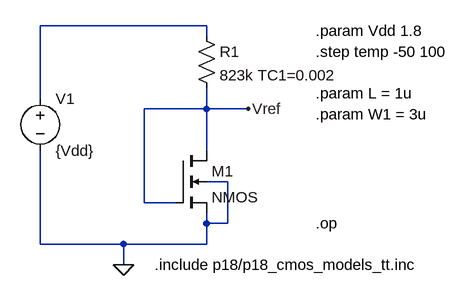
[diagram p0: schematic MOS_RESISTOR_V2-vref.asc]
MOS_RESISTOR_V2-vref.asc, the LTspice schematic file:
Version 4
SHEET 1 884 680
WIRE 240 -32 -16 -32
WIRE 240 -16 240 -32
WIRE -16 80 -16 -32
WIRE 240 96 240 64
WIRE 240 96 144 96
WIRE 304 96 240 96
WIRE 240 160 240 96
WIRE 272 208 240 208
WIRE 144 240 144 96
WIRE 192 240 144 240
WIRE 240 272 240 256
WIRE 272 272 272 208
WIRE 272 272 240 272
WIRE -16 304 -16 160
WIRE 112 304 -16 304
WIRE 240 304 240 272
WIRE 240 304 112 304
WIRE 112 336 112 304
FLAG 304 96 Vref
FLAG 112 336 0
SYMBOL nmos4 192 160 R0
SYMATTR InstName M1
SYMATTR Value2 l={L} w={W1}
SYMBOL voltage -16 64 R0
SYMATTR InstName V1
SYMATTR Value {Vdd}
SYMBOL res 224 -32 R0
SYMATTR InstName R1
SYMATTR Value 823k TC1=0.002
TEXT 408 -24 Left 2 !.param Vdd 1.8
TEXT 408 8 Left 2 !.step temp -50 100
TEXT 408 272 Left 2 !.op
TEXT 160 336 Left 2 !.include p18/p18_cmos_models_tt.inc
TEXT 408 72 Left 2 !.param L = 1u
TEXT 408 104 Left 2 !.param W1 = 3u

The netlist it stands for:
* MOS_RESISTOR_V2-vref.asc
M1 Vref Vref 0 0 NMOS l={L} w={W1}
V1 N001 0 {Vdd}
R1 N001 Vref 823k TC1=0.002
.model NMOS NMOS
.model PMOS PMOS
.lib standard.mos
.param Vdd 1.8
.step temp -50 100
.op
.include p18/p18_cmos_models_tt.inc
.param L = 1u
.param W1 = 3u
.backanno
.end